# EAGLE schematic Microcontroller_Atmel_ATtiny5_ATtiny10 (EAGLE 6.5.0)
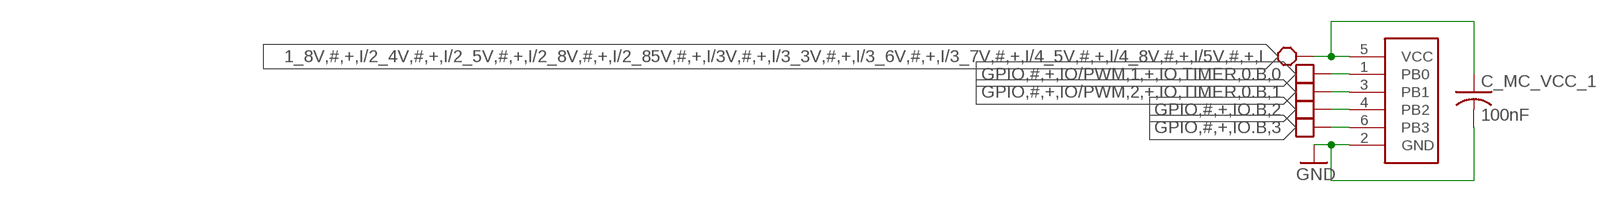
[diagram p0: schematic, sheet 1]

## Parts
C_MC_VCC_1  100nF  C-USC0603  [C0603]
U$1  ATTINY4/5/9/10  [SOT23-6]

## Nets
1_8V,#,+,I/2_4V,#,+,I/2_5V,#,+,I/2_8V,#,+,I/2_85V,#,+,I/3V,#,+,I/3_3V,#,+,I/3_6V,#,+,I/3_7V,#,+,I/4_5V,#,+,I/4_8V,#,+,I/5V,#,+,I: C_MC_VCC_1.1 U$1.5(VCC) ; supply symbol labelled BLOCK_REQUIREMENT
GND: C_MC_VCC_1.2 U$1.2(GND)
GPIO,#,+,IO.B,2: U$1.4(PB2) ; supply symbol labelled BLOCK_OPTIONAL
GPIO,#,+,IO.B,3: U$1.6(PB3) ; supply symbol labelled BLOCK_OPTIONAL
GPIO,#,+,IO/PWM,1,+,IO,TIMER,0.B,0: U$1.1(PB0) ; supply symbol labelled BLOCK_OPTIONAL
GPIO,#,+,IO/PWM,2,+,IO,TIMER,0.B,1: U$1.3(PB1) ; supply symbol labelled BLOCK_OPTIONAL

## Library data of the parts
C_MC_VCC_1 = rcl:C-US: CAPACITOR, American symbol
U$1 = block_parts:ATTINY4/5/9/10: ATtiny4, ATtiny5, ATtiny9, and ATtiny10 ATtiny4 <http://www.atmel.com/devices/ATTINY4.aspx> ATtiny5 <http://www.atmel.com/devices/ATTINY5.aspx> ATtiny9 <http://www.atmel.com/devices/ATTINY9.aspx> ATtiny10 <http://www.atmel.com/devices/ATTINY10.aspx>